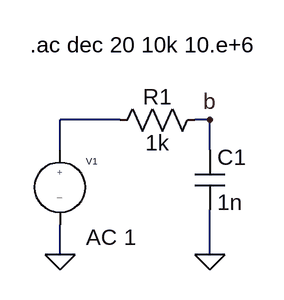
[diagram p0: schematic tiefpass_rc-tran.asc]
tiefpass_rc-tran.asc, the LTspice schematic file:
Version 4
SHEET 1 880 680
WIRE 160 144 96 144
WIRE 256 144 240 144
WIRE 96 176 96 144
WIRE 256 176 256 144
WIRE 96 288 96 256
WIRE 256 288 256 240
FLAG 256 288 0
FLAG 96 288 0
FLAG 256 144 b
SYMBOL cap 240 176 R0
SYMATTR InstName C1
SYMATTR Value 1n
SYMBOL res 144 160 R270
WINDOW 0 25 56 VTop 2
WINDOW 3 7 56 VBottom 2
SYMATTR InstName R1
SYMATTR Value 1k
SYMBOL source-V 96 160 R0
WINDOW 123 28 109 Left 2
WINDOW 39 0 0 Left 2
SYMATTR Value2 AC 1
SYMATTR InstName V1
SYMATTR Value ""
TEXT 64 64 Left 2 !.ac dec 20 10k 10.e+6

The netlist it stands for:
* tiefpass_rc-tran.asc
C1 b 0 1n
R1 N001 b 1k
V1 N001 0 AC 1
.ac dec 20 10k 10.e+6
.backanno
.end